# EAGLE design IST_03_ExpressionControl (EAGLE 4.16)
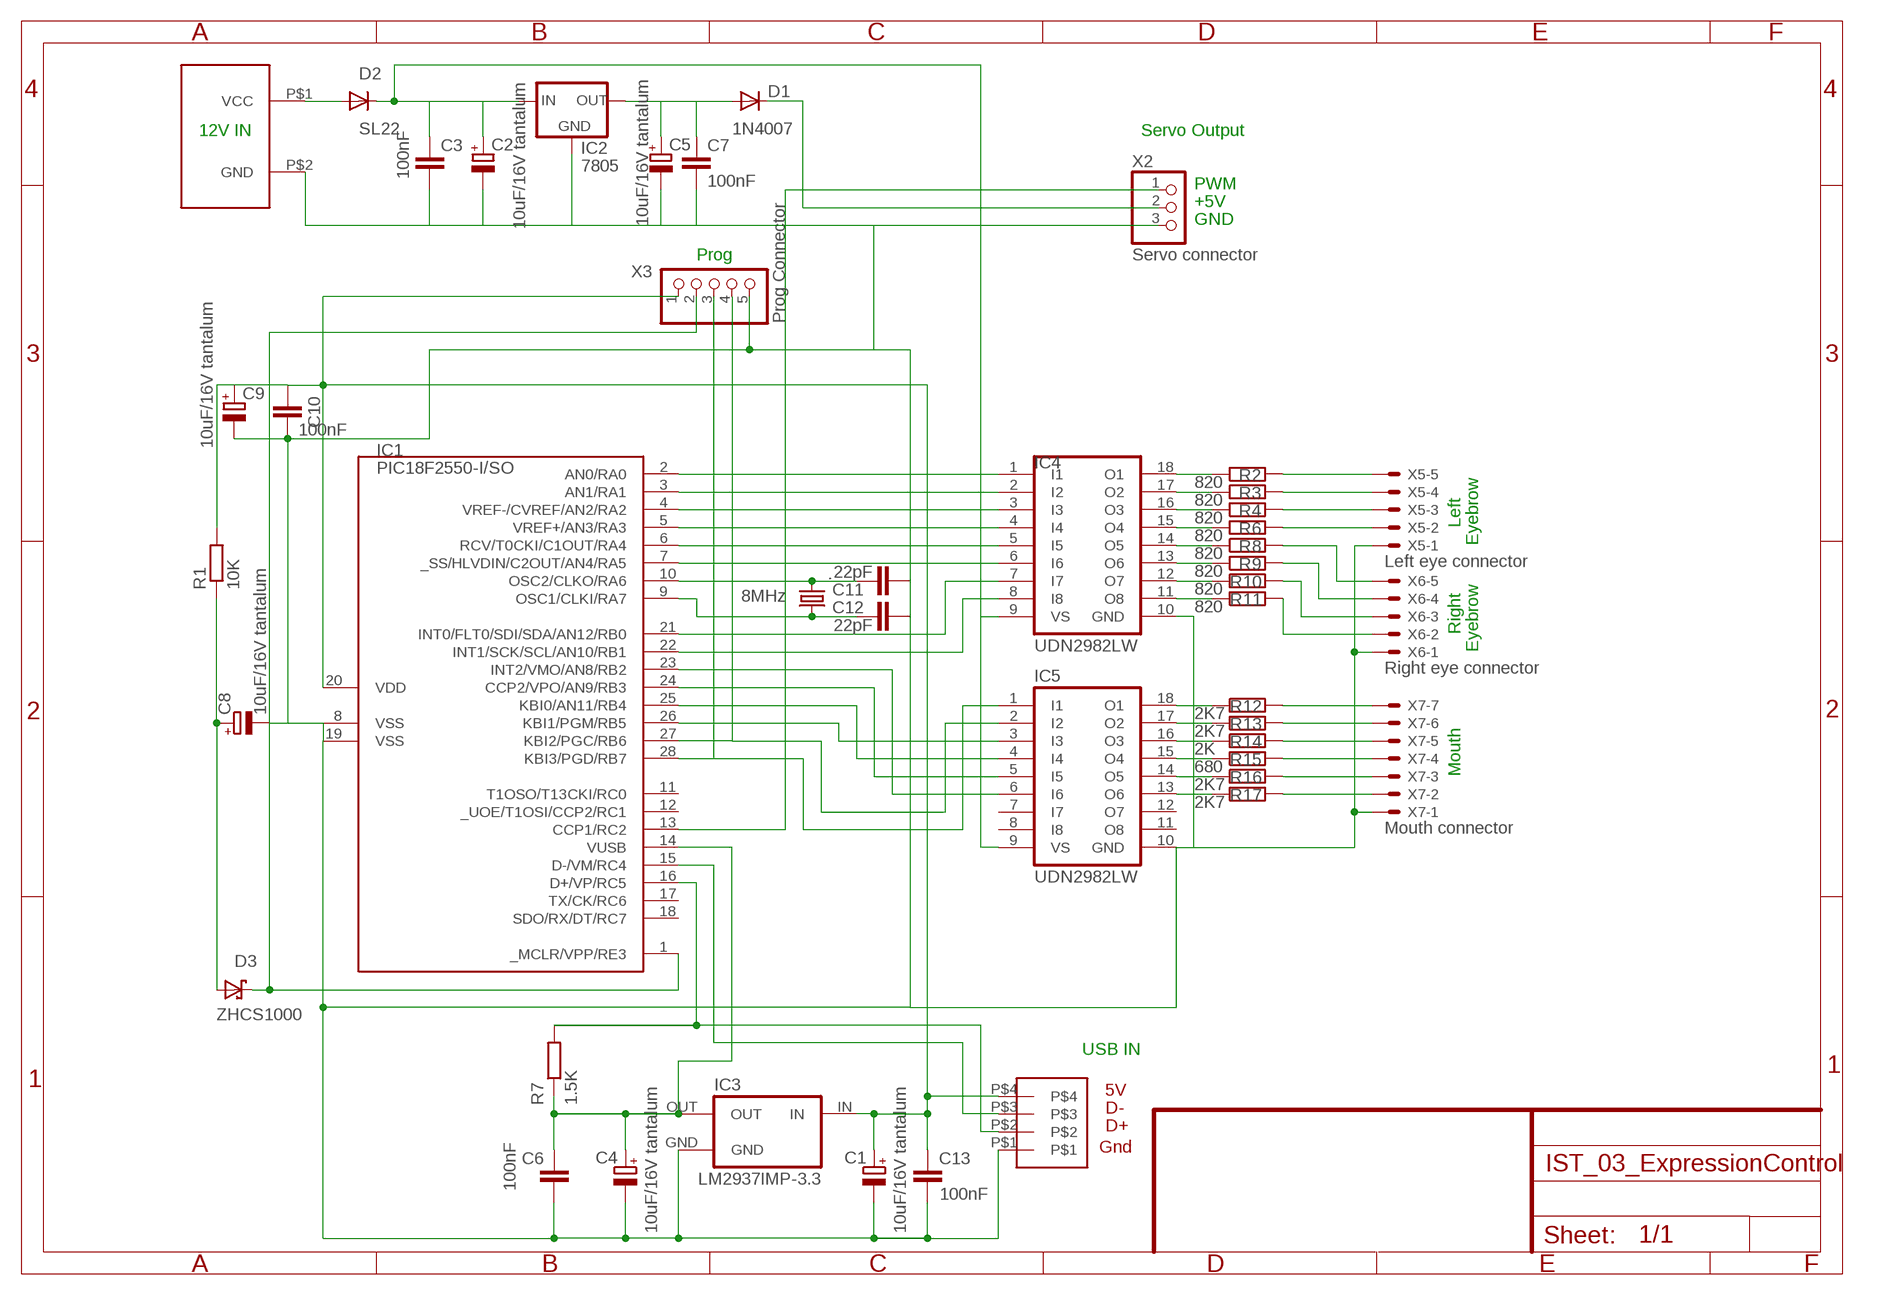
[diagram p0: schematic, sheet 1]

## Parts
.  8MHz  CRYTALHC49S  [HC49/S]
C1  10uF/16V tantalum  CPOL-EUCT3528  [CT3528]
C2  10uF/16V tantalum  CPOL-EUCT3528  [CT3528]
C3  100nF  C-EUC1206K  [C1206K]
C4  10uF/16V tantalum  CPOL-EUCT3528  [CT3528]
C5  10uF/16V tantalum  CPOL-EUCT3528  [CT3528]
C6  100nF  C-EUC1206K  [C1206K]
C7  100nF  C-EUC1206K  [C1206K]
C8  10uF/16V tantalum  CPOL-EUCT3528  [CT3528]
C9  10uF/16V tantalum  CPOL-EUCT3528  [CT3528]
C10  100nF  C-EUC1206  [C1206]
C11  22pF  C-EUC1206K  [C1206K]
C12  22pF  C-EUC1206K  [C1206K]
C13  100nF  C-EUC1206K  [C1206K]
D1  1N4007  1N4004  [DO41-10]
D2  SL22  DIODE-SMB  [SMB]
D3  ZHCS1000  [SOT-23]
IC1  PIC18F2550-I/SO  [SO-28W]
IC2  7805  78XXL  [78XXL]
IC3  LM2937IMP-3.3  [SOT223]
IC4  UDN2982LW  [SO18W]
IC5  UDN2982LW  [SO18W]
R1  10K  R-EU_R1206W  [R1206W]
R2  820  R-EU_R0805W  [R0805W]
R3  820  R-EU_R0805W  [R0805W]
R4  820  R-EU_R0805W  [R0805W]
R6  820  R-EU_R0805W  [R0805W]
R7  1.5K  R-EU_R1206W  [R1206W]
R8  820  R-EU_R0805W  [R0805W]
R9  820  R-EU_R0805W  [R0805W]
R10  820  R-EU_R0805W  [R0805W]
R11  820  R-EU_R0805W  [R0805W]
R12  2K7  R-EU_R0805W  [R0805W]
R13  2K7  R-EU_R0805W  [R0805W]
R14  2K  R-EU_R0805W  [R0805W]
R15  680  R-EU_R0805W  [R0805W]
R16  2K7  R-EU_R0805W  [R0805W]
R17  2K7  R-EU_R0805W  [R0805W]
X1  12V power connector  MICROMATE-N-LOK90  [MICROMATE-N-LOK90]
X2  Servo connector  PINHD-1X3  [1X03]
X3  Prog Connector  PINHD-1X5  [1X05]
X4  USB connector  PHCON4  [PHCONNECTOR4]
X5  Left eye connector  53261-05  [53261-05]
X6  Right eye connector  53261-05  [53261-05]
X7  Mouth connector  53261-07  [53261-07]

## Nets
+5V [Small20]: D2.A X1.P$1(VCC)
GND2 [Small12]: C1.- C2.- C3.2 C4.- C5.- C6.2 C7.2 C8.- C9.- C10.2 C11.1 C12.1 C13.2 IC1.8(VSS) IC1.19(VSS) IC2.GND IC3.GND IC4.10(GND) IC5.10(GND) X1.P$2(GND) X2.3 X3.5 X4.P$1 X5.1 X6.1 X7.1
N$1 [Small12]: IC1.13(CCP1/RC2) X2.1
N$2 [Small12]: IC1.2(AN0/RA0) IC4.1(I1)
N$3 [Small12]: C1.+ C9.+ C10.1 C13.1 IC1.20(VDD) IC3.IN R1.2 X3.1 X4.P$4
N$4 [Small12]: R8.2 X6.5
N$5 [Small12]: R6.2 X5.2
N$6 [Small20]: D1.C X2.2
N$7 [Small12]: D3.1(K) IC1.1(_MCLR/VPP/RE3) X3.2
N$8 [Small12]: IC4.18(O1) R2.1
N$9 [Small12]: IC1.28(KBI3/PGD/RB7) IC5.1(I1) X3.3
N$10 [Small12]: IC4.17(O2) R3.1
N$11 [Small12]: IC4.16(O3) R4.1
N$12 [Small12]: IC4.15(O4) R6.1
N$13 [Small12]: IC1.27(KBI2/PGC/RB6) IC5.2(I2) X3.4
N$14 [Small12]: IC4.14(O5) R8.1
N$15 [Small12]: ..2 C11.2 IC1.10(OSC2/CLKO/RA6)
N$16 [Small12]: ..1 C12.2 IC1.9(OSC1/CLKI/RA7)
N$17 [Small12]: IC4.13(O6) R9.1
N$18 [Small12]: IC4.12(O7) R10.1
N$19 [Small12]: IC4.11(O8) R11.1
N$20 [Small12]: IC5.18(O1) R12.1
N$21 [Small12]: IC5.17(O2) R13.1
N$22 [Small12]: IC5.16(O3) R14.1
N$23 [Small12]: IC1.15(D-/VM/RC4) X4.P$3
N$24 [Small12]: IC5.15(O4) R15.1
N$25 [Small12]: IC5.14(O5) R16.1
N$26 [Small12]: C4.+ C6.1 IC1.14(VUSB) IC3.OUT R7.1
N$27 [Small12]: IC1.26(KBI1/PGM/RB5) IC5.3(I3)
N$28 [Small12]: IC1.25(KBI0/AN11/RB4) IC5.4(I4)
N$29 [Small12]: IC1.24(CCP2/VPO/AN9/RB3) IC5.5(I5)
N$30 [Small12]: IC1.23(INT2/VMO/AN8/RB2) IC5.6(I6)
N$31 [Small12]: C8.+ D3.3(A) R1.1
N$32 [Small12]: IC1.16(D+/VP/RC5) R7.2 X4.P$2
N$33 [Small12]: IC1.22(INT1/SCK/SCL/AN10/RB1) IC4.8(I8)
N$34 [Small12]: IC1.21(INT0/FLT0/SDI/SDA/AN12/RB0) IC4.7(I7)
N$35 [Small12]: IC5.13(O6) R17.1
N$36 [Small20]: C5.+ C7.1 D1.A IC2.OUT
N$37 [Small12]: R4.2 X5.3
N$38 [Small12]: R3.2 X5.4
N$39 [Small12]: IC1.7(_SS/HLVDIN/C2OUT/AN4/RA5) IC4.6(I6)
N$40 [Small12]: IC1.6(RCV/T0CKI/C1OUT/RA4) IC4.5(I5)
N$41 [Small12]: IC1.5(VREF+/AN3/RA3) IC4.4(I4)
N$42 [Small12]: IC1.4(VREF-/CVREF/AN2/RA2) IC4.3(I3)
N$43 [Small12]: IC1.3(AN1/RA1) IC4.2(I2)
N$44 [Small12]: R9.2 X6.4
N$45 [Small12]: R2.2 X5.5
N$46 [Small12]: R12.2 X7.7
N$47 [Small12]: R13.2 X7.6
N$48 [Small12]: R10.2 X6.3
N$49 [Small12]: R11.2 X6.2
N$50 [Small12]: R14.2 X7.5
N$51 [Small12]: R15.2 X7.4
N$52 [Small12]: R16.2 X7.3
N$53 [Small12]: R17.2 X7.2
N$54 [Small20]: C2.+ C3.1 D2.C IC2.IN IC4.9(VS) IC5.9(VS)
Unconnected: IC1.11(T1OSO/T13CKI/RC0) IC1.12(_UOE/T1OSI/CCP2/RC1) IC1.17(TX/CK/RC6) IC1.18(SDO/RX/DT/RC7) IC5.7(I7) IC5.8(I8) IC5.11(O8) IC5.12(O7)

## Notes on the sheet
- 12V IN | Servo Output
- PWM
- +5V
- GND
- Prog
- Left
- Eyebrow
- Right
- Eyebrow
- Mouth
- USB IN
- 5V
- D-
- D+
- Gnd

## Power pins joined to a net without a drawn wire
GND: IC3.GND@(GND)

## Library data of the parts
. = crystal:CRYTAL: CRYSTAL
C1 C2 C4 C5 C8 C9 = rcl:CPOL-EU: POLARIZED CAPACITOR, European symbol
C3 C6 C7 C10-C13 = rcl:C-EU: CAPACITOR, European symbol
D1 = diode:1N4004: DIODE general purpose rectifier, 1 A
D2 = diode:DIODE-: DIODE
D3 = zetex:ZHCS1000: DIODE
IC1 = microchip-pic18fxx5x:PIC18*2550: PIC18*2550 Microchip FLASH Microcontroller with FS-USB DEVICE FEATURES Feature PIC18*2550 Program Memory (bytes) 32k Program Memory (instructions) 16384 I/O Ports Ports A, B, C, (E) Capture/Compare/PWM Modules 2 Enhanced Capture/Compare/PWM Modules 0 Parallel Communications (PSP) No 10-bit Analog-to-Digital Module 10 input Channels Package Types 28-pin PDIP 28-pin SOIC NOTES: F only after 18, means standard voltage range from 4.2v to 5.5v LF after 18, means extended voltage range from 2.0v to 5.5v T after entire device number, means supplied in tape and reel TQFP packages only -E before / denotes extended temperature range from -40°C to +120°C -I before / denotes industrial temperature range from -40°C to +85°C /PT suffix denotes TQFP package /SO suffix denotes SOIC package /SP suffix denotes Skinny Plastic DIP package /P suffix denotes Plastic DIP package /ML suffix denotes QFN package
IC2 = v-reg:78XXL: VOLTAGE REGULATOR
IC3 = lm2937:LM2937IMP-*: 400 and 500 mA Low Dropout Voltage Regulator NATIONAL SEMICONDUCTOR created by Peter.Hofmann@ph-tronic.de <mailto:Reter.Hofmann@ph-tronic.de> 10-2004 Rev.0
IC4 IC5 = uln-udn:UDN2982LW
R1-R4 R6-R17 = rcl:R-EU_: RESISTOR, European symbol
X1 = Carlos1:MICROMATE-N-LOK90
X2 = pinhead:PINHD-1X3: PIN HEADER
X3 = pinhead:PINHD-1X5: PIN HEADER
X4 = Carlos1:PHCON4
X5 X6 = con-molex:53?-05: CONNECTOR wire to board 1.25 mm (.049 inch) pitch header
X7 = con-molex:53?-07: CONNECTOR wire to board 1.25 mm (.049 inch) pitch header

## Net classes
1 Small12: width 0.305 mm, drill 0.305 mm, clearance 0.7 mm
2 Small20: width 0.508 mm, drill 0.305 mm, clearance 0.7 mm
3 Small30: width 0.762 mm, drill 0.305 mm, clearance 0.7 mm
4 Power60: width 1.524 mm, drill 0.508 mm, clearance 1.1 mm
5 POWER150: width 3.81 mm, drill 0.508 mm, clearance 2.1 mm

## Board
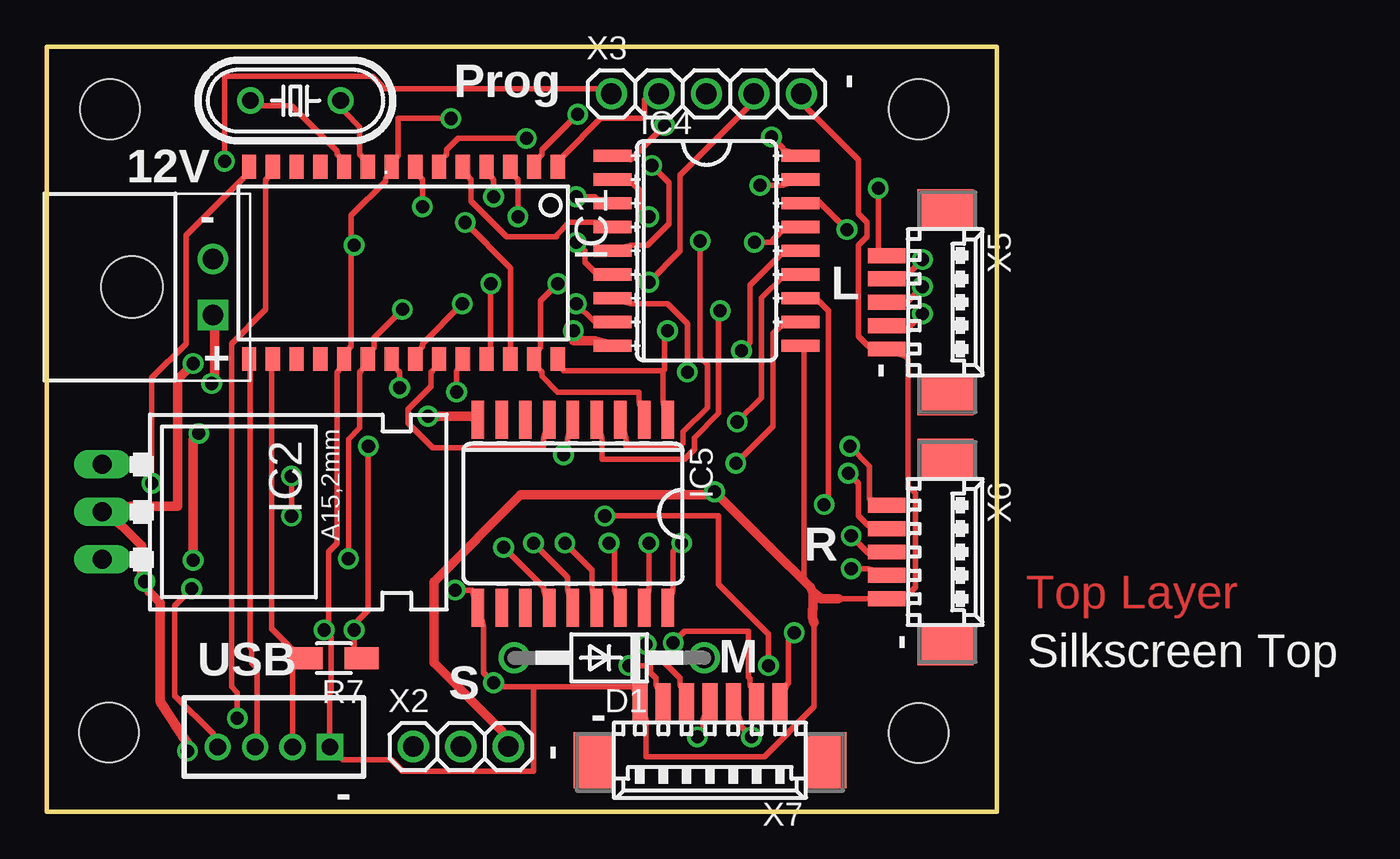
[diagram p1: board, top side]
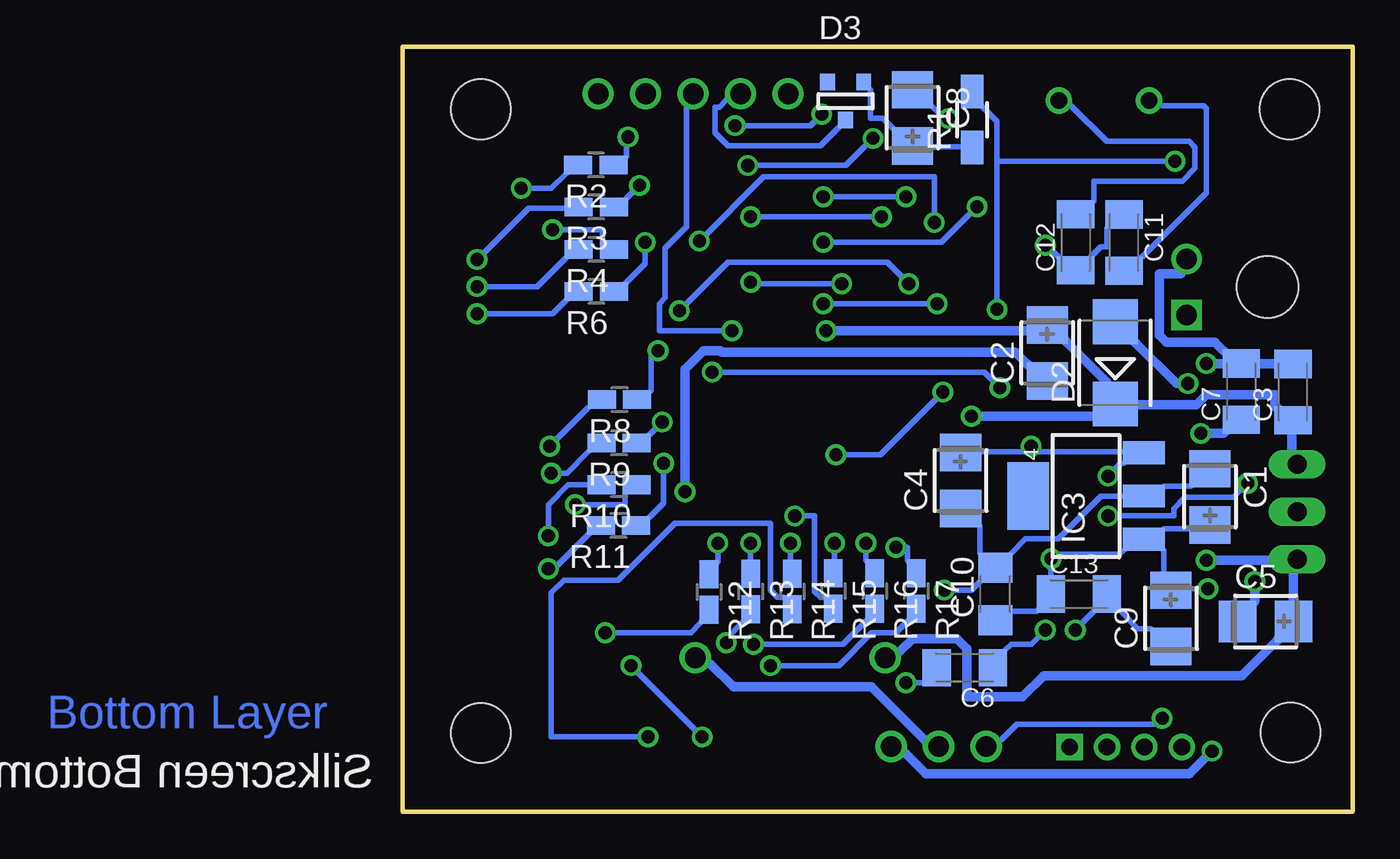
[diagram p2: board, bottom side, seen from below]

Size 50.83 x 40.91 mm. Coordinates in mm from the lower left corner, seen from the top.
Outline: 0,40.91 50.83,40.91 50.83,0 0,0 0,40.91
Copper layers (1*16): Top 0.035mm / dielectric 1.5mm / Bottom 0.035mm
Design rules "10mils": minimum track width 10mil, minimum drill 24mil, track to track 10mil, track to pad 10mil, pad to pad 10mil, via to via 10mil, smd to smd 10mil, copper to edge 40mil, drill to drill 10mil, minimum pad ring 10mil, minimum via ring 8mil, stop-mask expansion 0mil, vias tented up to drill 0mil, thermal gap 10mil
Holes 3.2 mm at 3.39,37.57 3.34,4.23 46.65,37.57 46.64,4.21

### Footprints (pad centres in the part's own frame; a part is rotated, then mirrored left to right if it is on the bottom)
HC49/S = drill 0.9 round: 1 -2.413,0; 2 2.413,0
CT3528 = smd 2 x 2.2: + 1.5,0; - -1.5,0
C1206K = smd 1.5 x 2: 1 -1.5,0; 2 1.5,0
C1206 = smd 1.6 x 1.8: 1 -1.4,0; 2 1.4,0
DO41-10 = drill 1.118 round: A 5.08,0; C -5.08,0
SMB = smd 2.4 x 2.4: A 2.2,0; C -2.2,0
SOT-23 = smd 0.787 x 0.889: 1 0.025,-1.016; 2 -0.94,1.016; 3 0.991,1.016
SO-28W = smd 0.762 x 1.27: 1 -7.62,-5.207; 2 -6.35,-5.207; 3 -5.08,-5.207; 4 -3.81,-5.207; 5 -2.54,-5.207; 6 -1.27,-5.207; 7 0,-5.207; 8 1.27,-5.207; 9 2.54,-5.207; 10 3.81,-5.207; 11 5.08,-5.207; 12 6.35,-5.207; 13 7.62,-5.207; 14 8.89,-5.207; 15 8.89,5.08; 16 7.62,5.08; 17 6.35,5.08; 18 5.08,5.08; 19 3.81,5.08; 20 2.54,5.08; 21 1.27,5.08; 22 0,5.08; 23 -1.27,5.08; 24 -2.54,5.08; 25 -3.81,5.08; 26 -5.08,5.08; 27 -6.35,5.08; 28 -7.62,5.08
78XXL = drill 1.016 long: GND 0,-3.81; IN -2.54,-3.81; OUT 2.54,-3.81
SOT223 = smd 1.219 x 2.235: GND 0,-3.099; IN -2.311,-3.099; OUT 2.311,-3.099 | smd 3.6 x 2.2: GND@ 0,3.099
SO18W = smd 0.66 x 2.032: 1 -5.715,-5.029; 2 -4.445,-5.029; 3 -3.175,-5.029; 4 -1.905,-5.029; 5 -0.635,-5.029; 6 0.635,-5.029; 7 1.905,-5.029; 8 3.175,-5.029; 9 4.445,-5.029; 10 4.445,5.029; 11 3.175,5.029; 12 1.905,5.029; 13 0.635,5.029; 14 -0.635,5.029; 15 -1.905,5.029; 16 -3.175,5.029; 17 -4.445,5.029; 18 -5.715,5.029
R1206W = smd 1.8 x 1.2: 1 -1.499,0; 2 1.499,0
R0805W = smd 1.5 x 1: 1 -0.94,0; 2 0.94,0
MICROMATE-N-LOK90 = drill 1.1 square: P$1 -1.5,0 | drill 1.1 round: P$2 1.5,0 | hole 3.3: 0,4.32
1X03 = drill 1.1 pad 1.676 round: 1 -2.54,0; 2 0,0; 3 2.54,0
1X05 = drill 1.1 pad 1.6 round: 1 -5.08,0; 2 -2.54,0; 3 0,0; 4 2.54,0; 5 5.08,0
PHCONNECTOR4 = drill 0.9 square: P$1 -3,0 | drill 0.9 round: P$2 -1,0; P$3 1,0; P$4 3,0
53261-05 = smd 0.8 x 2: 1 2.5,-2.5; 2 1.25,-2.5; 3 0,-2.5; 4 -1.25,-2.5; 5 -2.5,-2.5 | smd 2.1 x 3: S1 5,0.625; S2 -5,0.625
53261-07 = smd 0.8 x 2: 1 3.75,-2.5; 2 2.5,-2.5; 3 1.25,-2.5; 4 0,-2.5; 5 -1.25,-2.5; 6 -2.5,-2.5; 7 -3.75,-2.5 | smd 2.1 x 3: S1 6.25,0.625; S2 -6.25,0.625

### Placement (x,y rotation side)
.  13.31,38.04 180 top
C1  7.64,16.85 270 bottom
C2  16.34,24.54 90 bottom
C3  3.2,22.45 90 bottom
C4  20.98,17.72 90 bottom
C5  4.67,10.18 0 bottom
C6  20.76,7.7 180 bottom
C7  5.97,22.47 90 bottom
C8  23.56,37.12 270 bottom
C9  9.72,10.35 90 bottom
C10  19.12,11.64 90 bottom
C11  12.24,30.44 270 bottom
C12  14.82,30.46 90 bottom
C13  14.65,11.64 0 bottom
D1  30.1,8.23 180 top
D2  12.71,24.01 90 bottom
D3  27.16,38.01 0 bottom
IC1  19.72,29.29 180 top
IC2  6.79,16.03 270 top
IC3  14.27,16.89 90 bottom
IC4  35.3,29.37 270 top
IC5  27.52,15.95 180 top
R1  20.35,37.03 90 bottom
R2  40.5,34.59 180 bottom
R3  40.47,32.34 180 bottom
R4  40.47,30.07 180 bottom
R6  40.47,27.82 180 bottom
R7  15.35,8.21 180 top
R8  39.23,22.04 180 bottom
R9  39.25,19.72 180 bottom
R10  39.25,17.5 180 bottom
R11  39.28,15.31 180 bottom
R12  34.44,11.75 270 bottom
R13  32.22,11.78 270 bottom
R14  29.99,11.78 270 bottom
R15  27.8,11.81 270 bottom
R16  25.57,11.81 270 bottom
R17  23.35,11.81 270 bottom
X1  8.89,28.06 90 top
X2  22.15,3.49 0 top
X3  35.29,38.4 0 top
X4  12.15,3.46 180 top
X5  47.44,27.25 270 top
X6  47.44,13.89 270 top
X7  35.48,3.39 180 top

### Tracks (layer width: path | path; a pad name or v marks a point on that pad's centre or on a via)
+5V  (via drill 0.7)
  Top 0.508: v8.82,22.91 8.98,23.06 8.98,25.8 X1.P$1
  Bottom 0.508: v8.82,22.91 9.43,22.91 11.57,25.04 D2.A
GND2  (via drill 0.7)
  Top 0.305: 42.35,11.4 43.95,11.4 X6.1 45.93,11.48 46.47,12.01 46.47,17.04 46.08,17.42 46.08,24.2 45.93,24.35 X5.1 43.95,24.89 43.42,25.42 43.42,30.3 43.88,30.75 43.88,31.52 43.42,31.97 43.42,34.87 40.67,37.61 X3.5 | 41.16,11.52 40.52,12.54 40.52,24.66 IC4.10 | 16.29,30.3 16.29,31.9 18.12,33.73 18.12,33.88 IC1.8 18.81,35.1 18.81,37.08 v21.62,37.08 | 16.29,30.3 16.29,24.89 16.21,24.81 IC1.19 15.6,23.59 15.53,23.51 15.53,14.37 15.07,13.91 15.07,10.26 v14.84,9.72 15.22,9.34 15.22,6.45 15.15,6.37 15.15,4.16 X4.P$1 15.83,2.79 18.42,2.79 19.03,2.18 26.04,2.18 26.04,6.67 | 16.29,30.3 v16.44,30.3 | 26.04,6.67 24.44,6.67 v23.91,6.9 23.38,7.44 23.38,9.95 IC5.10 22.77,11.86 v21.85,11.86 | 26.04,6.67 31.38,6.67 X7.1 32.06,4.92 32.06,2.94 38.39,2.94 41.06,5.61 41.06,10.1
  Top 0.508: 41.06,10.1 40.98,10.3 40.98,10.39 40.98,10.82 40.99,10.82 40.99,11.75 | v7.83,23.97 6.99,23.13 6.99,16.35 4.48,16.35 IC2.GND 4.02,15.29 5.09,14.22 5.09,12.47 v5.24,12.31 5.47,11.78 6.08,11.17 6.08,5.89 7.53,3.63 v7.53,3.25 | X2.3 24.37,4.31 20.71,7.97 20.71,12.31 25.36,16.96 35.19,16.96 v35.72,17.11 38.69,14.14 40.87,12.01 41.06,11.52 | 41.06,11.52 41.16,11.52 41.22,11.43 40.99,11.75 | 41.06,11.52 41.13,11.45 | 40.99,11.75 41.37,11.44 41.43,11.4 42.35,11.4
  Bottom 0.305: C11.1 13.17,31.21 13.17,30.22 13.47,30.22 14,29.69 C12.1 15.76,29.69 16.37,30.3 v16.44,30.3 | v21.62,37.08 21.85,37.08 22.46,37.69 C8.- | C10.2 19.95,13.84 19.95,15.29 C4.- | C1.- 8.67,17.42 10.12,17.42 IC3.GND 13.47,16.89 15.76,14.6 17.51,14.6 18.27,13.84 C10.2 | C9.- 10.8,9.8 11.49,9.8 12.4,10.71 C13.2 13.85,10.71 v14.84,9.72 | v23.91,6.9 23,6.9 C6.2 | v21.85,11.86 20.41,11.86 19.95,12.31 C10.2
  Bottom 0.508: v5.24,12.31 5.24,11.25 C5.- | C3.2 4.17,23.97 5.01,23.97 C7.2 | C7.2 6.92,24.66 7.38,25.12 9.97,25.12 10.35,25.5 10.35,28.77 9.2,28.77 X1.P$2 | v7.83,23.97 6.92,23.97 C7.2 | v35.72,17.11 35.72,23.67 34.73,24.66 33.82,24.66 33.74,24.58 18.04,24.58 17.43,23.97 C2.- | v7.53,3.25 8.75,2.03 22.84,2.03 23.91,3.09 X2.3
N$1  (via drill 0.7)
  Top 0.305: v10.19,5 10.19,6.37 9.89,6.67 9.89,25.04 11.72,26.87 11.72,33.8 11.79,33.88 IC1.13
  Bottom 0.305: v10.19,5 10.5,4.69 17.97,4.69 18.81,3.86 X2.1
N$2  (via drill 0.7)
  Top 0.305: v28.41,37.31 26.5,35.4 26.5,35.17 26.43,35.1 IC1.2 | v33.05,36.7 31.23,34.87 IC4.1
  Bottom 0.305: v28.41,37.31 29.02,36.7 v33.05,36.7
N$3  (via drill 0.7)
  Top 0.305: v7.76,11.93 6.84,11.02 6.84,6.22 8.9,4.16 X4.P$4 | v16.14,13.53 16.14,19.93 16.75,20.54 16.75,23.51 16.82,23.59 IC1.20 17.51,24.81 17.51,25.34 v19.03,26.87 | v9.51,34.79 9.51,39.34 17.41,39.33 18.07,38.67 29.4,38.68 X3.1
  Bottom 0.305: C1.+ 8.67,15.13 10.12,15.13 IC3.IN | IC3.IN 10.12,13.99 10.12,12.77 C9.+ 8.67,11.93 v7.76,11.93 | C10.1 18.27,10.71 16.9,10.71 C13.1 16.14,12.62 v16.14,13.53 15.6,13.76 12.48,13.76 12.25,13.99 IC3.IN | v19.03,26.87 19.03,34.79 | 19.03,34.79 19.03,36.93 19.8,37.69 R1.2 | 19.03,34.79 v9.51,34.79
N$4  (via drill 0.7)
  Top 0.305: v42.96,19.55 44.03,18.49 44.03,16.73 X6.5
  Bottom 0.305: v42.96,19.55 40.9,21.61 R8.2
N$5  (via drill 0.7)
  Top 0.305: v46.85,26.64 45.93,25.72 X5.2
  Bottom 0.305: v46.85,26.64 42.81,26.64 42.12,27.32 R6.2
N$6
  Bottom 0.508: X2.2 22.92,3.86 25.74,6.67 33.13,6.67 34.35,7.89 D1.C
N$7
  Top 0.305: IC1.1 27.64,35.1 29.63,37.08 31.99,37.08 31.99,38.07 X3.2
  Bottom 0.305: D3.1 27.49,36.62 28.48,35.63 33.44,35.63 34.12,36.32 34.12,37.69 33.89,37.69 33.51,38.07 X3.2
N$8  (via drill 0.7)
  Top 0.305: v38.77,36.09 39.38,35.48 39.38,35.4 IC4.18
  Bottom 0.305: v38.77,36.09 38.85,36.09 38.85,35.02 R2.1
N$9  (via drill 0.7)
  Top 0.305: 32.98,23.59 27.64,23.59 IC1.28 | 32.98,23.59 32.98,21.91 IC5.1 | v33.21,25.72 33.05,25.57 33.05,23.67 32.98,23.59
  Bottom 0.305: v33.21,25.72 37.09,25.72 37.09,27.17 36.79,27.48 36.79,30.14 35.65,31.29 35.65,37.61 X3.3
N$10  (via drill 0.7)
  Top 0.305: v38.16,33.5 39.38,33.5 IC4.17
  Bottom 0.305: v38.16,33.5 38.85,32.81 R3.1
N$11  (via drill 0.7)
  Top 0.305: v42.81,31.13 41.28,32.66 IC4.16
  Bottom 0.305: v42.81,31.13 40.14,31.13 40.14,30.53 R4.1
N$12  (via drill 0.7)
  Top 0.305: v37.86,30.45 38.85,30.45 38.85,30.6 39.38,31.13 IC4.15
  Bottom 0.305: v37.86,30.45 37.86,29.31 38.85,28.32 R6.1
N$13  (via drill 0.7)
  Top 0.305: IC5.2 31.68,21.91 31.68,22.45 27.34,22.45 26.5,23.29 26.5,23.51 26.43,23.59 IC1.27 26.43,24.81 26.43,27.32 v27.34,28.24 | v32.22,28.32 33.89,29.99 33.89,34.03 37.47,37.61 X3.4
  Bottom 0.305: v32.22,28.32 32.14,28.24 v27.34,28.24
N$14  (via drill 0.7)
  Top 0.305: v37.17,24.66 37.63,25.12 37.63,28.16 39.38,29.92 IC4.14
  Bottom 0.305: v37.17,24.66 37.55,24.66 37.55,22.52 R8.1
N$15
  Top 0.305: IC1.10 15.6,35.1 15.53,35.17 15.53,35.33 13.09,37.76 11.57,37.76 ..2
  Bottom 0.305: C11.2 11.26,29.69 7.83,33.12 7.83,37.61 7.91,37.69 7.98,37.76 10.19,37.76 ..2
N$16
  Top 0.305: IC1.9 16.82,35.1 16.75,35.17 16.75,36.62 15.99,37.38 ..1
  Bottom 0.305: C12.2 13.85,32.66 13.85,33.73 9.13,33.73 8.44,34.41 8.44,34.49 8.44,35.54 8.52,35.63 8.75,35.86 13.17,35.86 15.07,37.76 ..1
N$17  (via drill 0.7)
  Top 0.305: v36.94,20.85 38.24,22.14 38.24,27.48 39.38,28.62 IC4.13
  Bottom 0.305: v36.94,20.85 37.63,20.16 R9.1
N$18  (via drill 0.7)
  Top 0.305: v41.59,16.43 41.82,16.66 41.82,26.79 41.28,27.32 IC4.12
  Bottom 0.305: v41.59,16.43 38.92,16.43 38.92,17.04 R10.1
N$19  (via drill 0.7)
  Top 0.305: v36.86,18.64 38.85,20.62 38.85,25.57 39.38,26.11 IC4.11
  Bottom 0.305: v36.86,18.64 36.86,16.5 37.63,15.74 R11.1
N$20  (via drill 0.7)
  Top 0.305: v33.97,14.37 33.51,13.91 33.51,11.86 IC5.18
  Bottom 0.305: v33.97,14.37 33.97,13.38 R12.1
N$21  (via drill 0.7)
  Top 0.305: v32.22,14.37 32.22,11.86 IC5.17
  Bottom 0.305: v32.22,14.37 R13.1
N$22  (via drill 0.7)
  Top 0.305: v30.08,14.37 30.39,14.07 30.39,11.86 IC5.16
  Bottom 0.305: v30.08,14.37 30.08,13.46 R14.1
N$23
  Top 0.305: IC1.15 10.88,23.59 10.88,8.81 10.96,8.73 10.96,7.97 11.26,7.67 11.26,4.16 X4.P$3
N$24  (via drill 0.7)
  Top 0.305: v27.72,14.37 29.17,12.92 29.17,11.86 IC5.15
  Bottom 0.305: v27.72,14.37 27.72,13.46 R15.1
N$25  (via drill 0.7)
  Top 0.305: v26.04,14.37 27.87,12.54 27.87,11.86 IC5.14
  Bottom 0.305: v26.04,14.37 26.04,13.46 R16.1
N$26  (via drill 0.7)
  Top 0.305: R7.1 16.44,8.81 v16.44,9.72 16.67,10.26 17.21,10.79 v17.21,19.55 | v5.62,17.57 5.62,23.21 7.45,25.04 7.45,30.83 10.5,33.88 IC1.14 | v13.09,15.82 v13.09,17.95
  Bottom 0.305: v16.44,9.72 17.21,8.96 18.27,8.96 18.58,8.66 C6.1 | v5.62,17.57 6.38,16.81 8.98,16.81 9.59,16.2 9.59,15.82 v13.09,15.82 | v13.09,17.95 12.4,18.64 12.25,18.64 IC3.OUT 12.25,19.25 17.21,19.25 | 17.21,19.25 19.95,19.25 C4.+ | 17.21,19.25 v17.21,19.55
N$27  (via drill 0.7)
  Top 0.305: v22.39,31.52 24.83,29.08 24.83,24.81 IC1.26 | v34.96,30.53 34.96,24.28 35.34,23.9 35.34,21.61 34.05,20.31 34.05,19.7 33.82,19.48 31,19.48 31,20.01 IC5.3
  Bottom 0.305: v22.39,31.52 22.39,33.95 31.53,33.95 v34.96,30.53
N$28  (via drill 0.7)
  Top 0.305: v23.76,28.24 23.76,24.81 IC1.25 | v36.03,26.79 35.95,26.72 35.95,21.31 34.65,20.01 34.65,19.4 34.12,18.87 29.7,18.87 29.7,20.01 IC5.4
  Bottom 0.305: v23.76,28.24 24.9,29.38 33.44,29.38 v36.03,26.79
N$29  (via drill 0.7)
  Top 0.305: v21.93,22.45 21.93,23.59 IC1.24 | v27.64,19.1 27.87,19.32 27.87,20.01 IC5.5
  Bottom 0.305: v21.93,22.45 25.28,19.1 v27.64,19.1
N$30
  Top 0.305: IC1.23 20.63,23.59 20.56,23.51 20.56,22.75 19.34,21.53 19.34,20.77 20.63,19.48 26.58,19.48 26.58,20.01 IC5.6
N$31
  Bottom 0.305: D3.3 25.82,38.6 25.82,37.08 25.13,37.08 24.6,36.55 C8.+ 22.46,35.55 20.94,35.55 R1.1
N$32
  Top 0.305: IC1.16 12.02,23.59 12.02,9.8 13.01,8.81 R7.2 13.17,7.67 13.17,4.16 X4.P$2
N$33  (via drill 0.7)
  Top 0.305: v22.23,27.17 20.1,25.04 20.1,24.89 20.02,24.81 IC1.22 | v28.33,27.17 29.32,26.18 IC4.8
  Bottom 0.305: v22.23,27.17 v28.33,27.17
N$34  (via drill 0.7)
  Top 0.305: v18.88,22.68 18.88,23.51 18.81,23.59 IC1.21 | v34.27,23.51 34.27,26.11 33.21,27.17 31.23,27.17 IC4.7
  Bottom 0.305: v18.88,22.68 19.72,23.51 v34.27,23.51
N$35  (via drill 0.7)
  Top 0.305: v24.44,14.14 26.58,12.01 26.58,11.86 IC5.13
  Bottom 0.305: v24.44,14.14 23.83,14.14 23.83,13.46 R17.1
N$36  (via drill 0.7)
  Top 0.508: v8.14,20.24 7.83,19.93 v7.83,13.46
  Bottom 0.508: v8.14,20.24 6.92,20.24 C7.1 | v7.83,13.46 4.48,13.46 IC2.OUT 3.18,12.77 3.18,11.25 C5.+ 4.1,9.11 5.93,7.28 16.52,7.28 17.66,6.14 20.63,6.14 20.63,8.73 21.17,9.27 23.53,9.27 24.22,8.58 D1.A
N$37  (via drill 0.7)
  Top 0.305: v46.85,28.09 45.93,27.17 X5.3
  Bottom 0.305: v46.85,28.09 43.65,28.09 42.12,29.61 R4.2
N$38  (via drill 0.7)
  Top 0.305: v46.85,29.53 45.93,28.62 X5.4
  Bottom 0.305: v46.85,29.53 44.1,32.28 42.12,32.28 R3.2
N$39  (via drill 0.7)
  Top 0.305: v20.1,32.35 20.1,33.8 20.02,33.88 IC1.7 | v28.33,30.45 28.79,29.99 28.79,29.38 29.32,28.85 IC4.6
  Bottom 0.305: v20.1,32.35 22.01,30.45 v28.33,30.45
N$40  (via drill 0.7)
  Top 0.305: v25.66,36.01 22.01,36.01 21.4,35.4 21.4,35.17 21.32,35.1 IC1.6 | v32.37,34.56 33.28,33.65 33.28,31.44 32.14,30.3 31.23,30.3 IC4.5
  Bottom 0.305: v25.66,36.01 27.11,34.56 v32.37,34.56
N$41
  Top 0.305: IC1.5 22.62,33.88 22.69,33.8 22.69,32.66 24.6,30.75 27.26,30.75 27.26,30.83 27.95,31.52 29.32,31.52 IC4.4
N$42  (via drill 0.7)
  Top 0.305: v23.91,32.89 23.91,33.8 23.83,33.88 IC1.4 | v28.33,32.89 29.32,32.89 29.32,32.81 IC4.3
  Bottom 0.305: v23.91,32.89 v28.33,32.89
N$43  (via drill 0.7)
  Top 0.305: v25.21,31.82 25.21,33.8 25.13,33.88 IC1.3 | v32.22,31.82 31.76,31.82 31.76,33.19 31.23,33.73 IC4.2
  Bottom 0.305: v25.21,31.82 v32.22,31.82
N$44  (via drill 0.7)
  Top 0.305: v42.88,18.1 43.42,17.57 43.42,15.82 43.95,15.29 X6.4
  Bottom 0.305: v42.88,18.1 42.05,18.1 40.9,19.25 R9.2
N$45  (via drill 0.7)
  Top 0.305: v44.48,33.34 44.48,30.14 X5.5
  Bottom 0.305: v44.48,33.34 42.88,33.34 42.12,34.11 R2.2
N$46  (via drill 0.7)
  Top 0.305: v39.99,9.57 39.68,9.27 39.68,6.9 39.61,6.83 X7.7
  Bottom 0.305: v39.99,9.57 35.42,9.57 34.88,10.1 R12.2
N$47  (via drill 0.7)
  Top 0.305: v33.51,9.04 34.12,9.65 37.55,9.65 37.55,7.21 37.63,7.13 37.63,6.83 X7.6
  Bottom 0.305: v33.51,9.04 33.51,9.27 32.67,10.1 R13.2
N$48  (via drill 0.7)
  Top 0.305: v43.04,14.75 43.95,13.84 X6.3
  Bottom 0.305: v43.04,14.75 43.04,16.43 41.97,17.5 R10.2
N$49  (via drill 0.7)
  Top 0.305: v43.04,13 43.95,13 X6.2
  Bottom 0.305: v43.04,13 42.73,13 40.9,14.83 R11.2
N$50  (via drill 0.7)
  Top 0.305: v37.7,4.01 37.09,4.62 37.09,4.92 X7.5
  Bottom 0.305: v37.7,4.01 42.88,4.01 42.88,11.7 42.2,12.39 39.3,12.39 36.26,15.44 31.15,15.44 31.15,11.86 30.77,11.48 30.46,11.48 R14.2
N$51  (via drill 0.7)
  Top 0.305: v29.85,15.82 35.95,15.82 35.95,12.16 38.62,9.49 v38.62,7.82 | v34.81,4.01 35.11,4.31 35.11,4.92 X7.4
  Bottom 0.305: v29.85,15.82 28.79,15.82 28.79,11.78 28.48,11.48 28.25,11.48 R15.2 | v38.62,7.82 v34.81,4.01
N$52  (via drill 0.7)
  Top 0.305: v32.06,8.96 33.89,7.13 33.89,6.83 X7.3
  Bottom 0.305: v32.06,8.96 27.26,8.96 26.04,10.18 R16.2
N$53  (via drill 0.7)
  Top 0.305: v31.15,7.82 32.29,7.82 32.29,7.44 32.6,7.13 32.6,6.83 X7.2
  Bottom 0.305: v31.15,7.82 27.49,7.82 25.74,9.57 24.44,9.57 23.83,10.18 R17.2
N$54  (via drill 0.7)
  Top 0.508: v28.18,25.72 28.18,25.19 29.32,25.19 IC4.9 | v20.41,21.15 22.77,21.15 IC5.9
  Bottom 0.508: v28.18,25.72 17.43,25.72 C2.+ 15.3,25.12 13.17,22.98 D2.C | IC2.IN 3.26,19.32 3.26,20.24 C3.1 4.17,21.69 4.17,22.3 7.83,22.3 8.37,21.76 11.57,21.76 D2.C | v20.41,21.15 13.85,21.15 D2.C

### Text on the board
Top: Top Layer
Bottom: Bottom Layer
Pads: Pads & Vias
Holes: Holes
_tplace: - | Prog | 12V | - | L | + | - | R | - | M | S | Silkscreen Top | USB | - | - | -
_bplace: Silkscreen Bottom